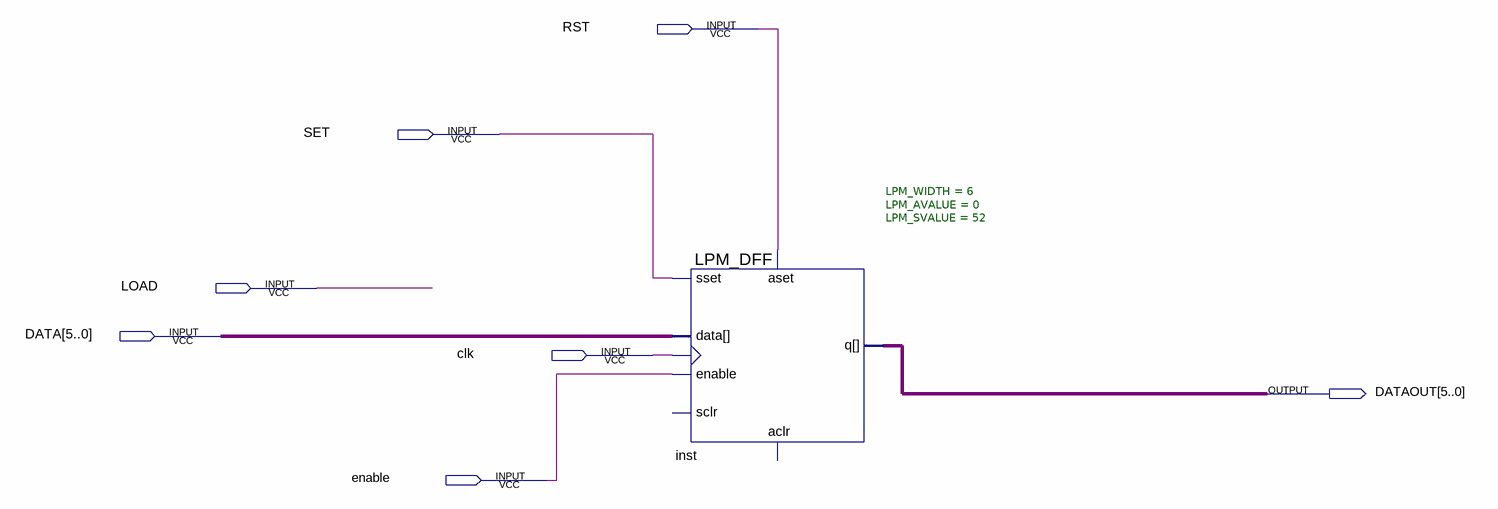
[diagram p0: schematic sheet]
// Quartus schematic FFTEST.bdf as structural Verilog: 1 symbols, 7 pins
module FFTEST (
  input  RST,
  input  SET,
  input  LOAD,
  input  [5:0] DATA,
  input  clk,
  input  enable,
  output [5:0] DATAOUT
);

  LPM_DFF #(.LPM_WIDTH(6), .LPM_AVALUE(0), .LPM_SVALUE(52)) inst (
    .aset(RST), .clock(clk), .data(DATA), .enable(enable), .sset(SET), .q(DATAOUT));  // open: aclr, sclr
endmodule
